# Altium schematic sheet DSM_VB2032-241203_Sch.SchDoc
size A3; SheetNumber: 1; SheetTotal: 1
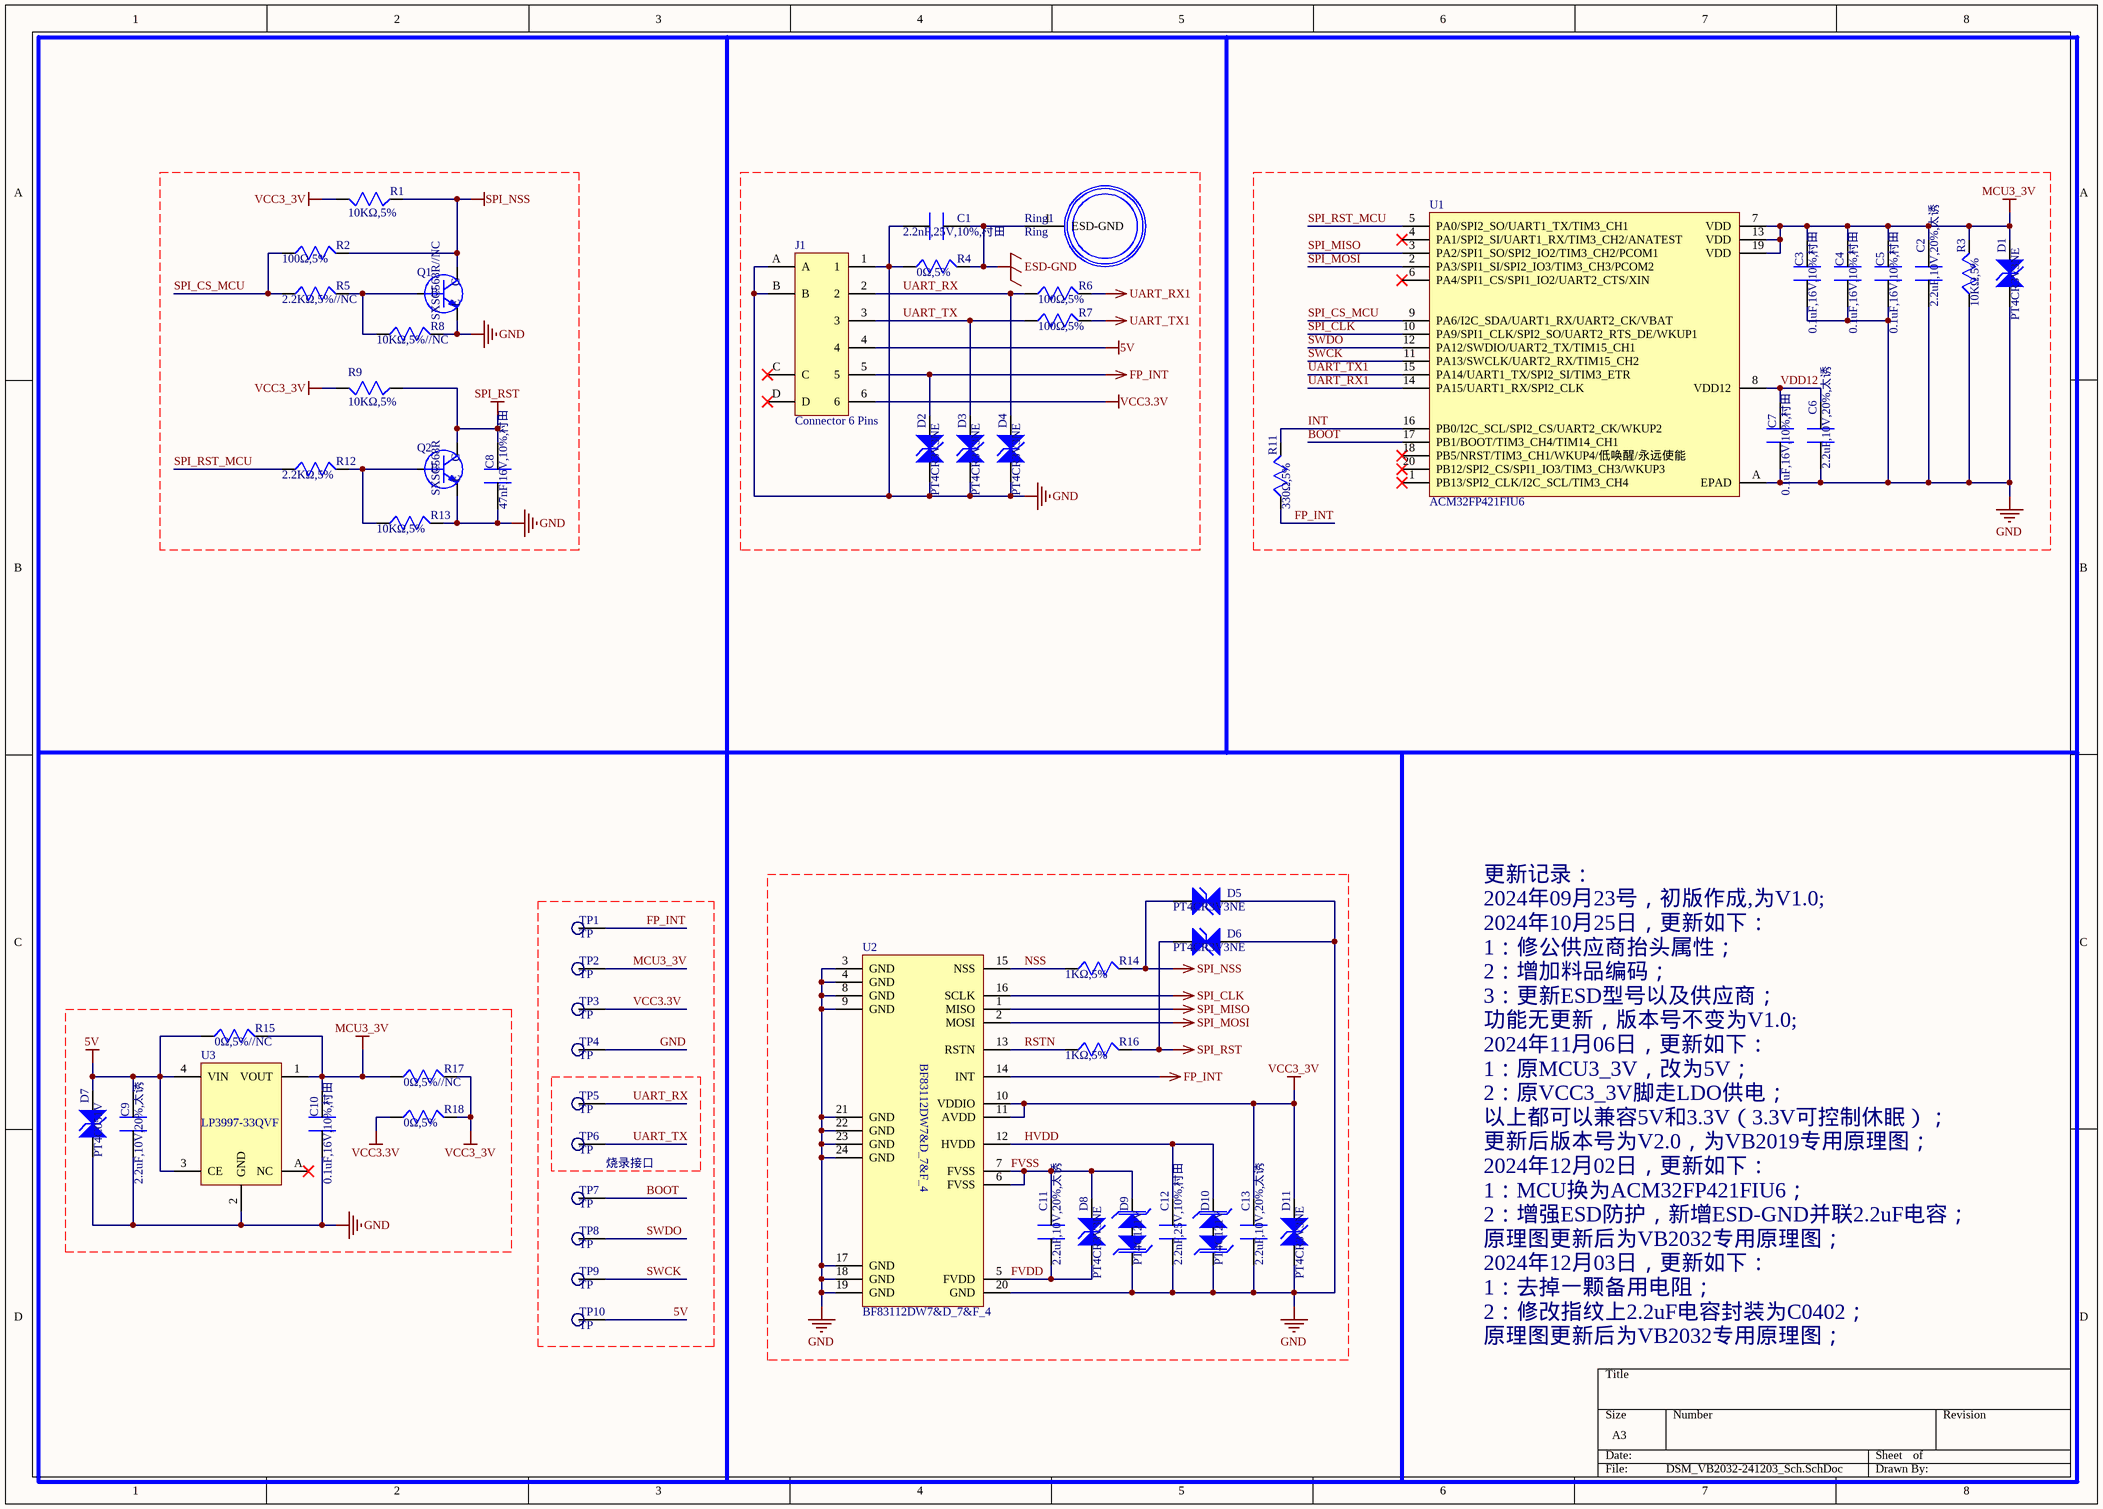
[diagram p0: DSM_VB2032-241203_Sch.SchDoc]

## Parts
C1  2.2nF,25V,10%,村田  [C0201]
C2  2.2uF,10V,20%,太诱  [C0201]
C3  0.1uF,16V,10%,村田  [C0201]
C4  0.1uF,16V,10%,村田  [C0201]
C5  0.1uF,16V,10%,村田  [C0201]
C6  2.2uF,10V,20%,太诱  [C0201]
C7  0.1uF,16V,10%,村田  [C0201]
C8  47nF,16V,10%,村田  [C0201]
C9  2.2uF,10V,20%,太诱  [C0201]
C10  0.1uF,16V,10%,村田  [C0201]
C11  2.2uF,10V,20%,太诱  [CC0402-M]
C12  2.2nF,25V,10%,村田  [C0201]
C13  2.2uF,10V,20%,太诱  [CC0402-M]
D1  PT4CR3V3NE  [SOD-962]
D2  PT4CR3V3NE  [SOD-962]
D3  PT4CR3V3NE  [SOD-962]
D4  PT4CR3V3NE  [SOD-962]
D5  PT4CR3V3NE  [SOD-962]
D6  PT4CR3V3NE  [SOD-962]
D7  PT4C051V  [DFN0603-2L 0.3*0.23 Pitch 0.38]
D8  PT4CR3V3NE  [SOD-962]
D9  PT4C121V  [SOD-962]
D10  PT4C121V  [SOD-962]
D11  PT4CR3V3NE  [SOD-962]
J1  Connector 6 Pins  [A1004LF-06A]
Q1  SXSC568R//NC  [SOT-723]
Q2  SXSC568R  [SOT-723]
R1  10KΩ,5%  [R0201]
R2  100Ω,5%  [R0201]
R3  10KΩ,5%  [R0201]
R4  0Ω,5%  [R0201]
R5  2.2KΩ,5%//NC  [R0201]
R6  100Ω,5%  [R0201]
R7  100Ω,5%  [R0201]
R8  10KΩ,5%//NC  [R0201]
R9  10KΩ,5%  [R0201]
R11  330Ω,5%  [R0201]
R12  2.2KΩ,5%  [R0201]
R13  10KΩ,5%  [R0201]
R14  1KΩ,5%  [R0201]
R15  0Ω,5%//NC  [R0201]
R16  1KΩ,5%  [R0201]
R17  0Ω,5%//NC  [R0201]
R18  0Ω,5%  [R0201]
Ring1  Ring  [Ring]
TP1  TP  [TP（Φ0.5）]
TP2  TP  [TP（Φ0.5）]
TP3  TP  [TP（Φ0.5）]
TP4  TP  [TP（Φ0.5）]
TP5  TP  [TP（Φ0.5）]
TP6  TP  [TP（Φ0.5）]
TP7  TP  [TP（Φ0.5）]
TP8  TP  [TP（Φ0.5）]
TP9  TP  [TP（Φ0.5）]
TP10  TP  [TP（Φ0.5）]
U1  ACM32FP421FIU6  [QFN 20 3*3 Pitch 0.4]
U2  BF83112DW7&D_7&F_4  [BF83112DW7&D_7&F_4]
U3  LP3997-33QVF  [DFN 1*1-4L]

## Nets
5V: C9.2 D7.2 J1.4 R15.1 TP10.1 U3.3(CE) U3.4(VIN)
ESD-GND: C1.1 R4.2 Ring1.1(ESD-GND)
FP_INT: D2.2 J1.5 R11.1 TP1.1 U2.14(INT)
GND: C1.2 C2.1 C3.1 C4.1 C5.1 C6.1 C7.1 C8.1 C9.1 C10.1 C12.1 C13.1 D1.1 D2.1 D3.1 D4.1 D5.1 D6.1 D7.1 D9.2 D10.2 D11.1 J1.1 J1.A J1.B Q1.2(E) Q2.2(E) R3.1 R4.1 R8.2 R13.2 TP4.1 U1.A(EPAD) U2.3(GND) U2.4(GND) U2.8(GND) U2.9(GND) U2.17(GND) U2.18(GND) U2.19(GND) U2.20(GND) U2.21(GND) U2.22(GND) U2.23(GND) U2.24(GND) U3.2(GND)
MCU3_3V: C2.2 C3.2 C4.2 C5.2 C10.2 D1.2 R3.2 R15.2 R17.1 TP2.1 U1.7(VDD) U1.13(VDD) U1.19(VDD) U3.1(VOUT)
SPI_CLK: U1.10(PA9/SPI1_CLK/SPI2_SO/UART2_RTS_DE/WKUP1) U2.16(SCLK)
SPI_MISO: U1.3(PA2/SPI1_SO/SPI2_IO2/TIM3_CH2/PCOM1) U2.1(MISO)
SPI_MOSI: U1.2(PA3/SPI1_SI/SPI2_IO3/TIM3_CH3/PCOM2) U2.2(MOSI)
SPI_NSS: D5.2 Q1.3(C) R1.1 R2.2 R14.2
SPI_RST: C8.2 D6.2 Q2.3(C) R9.1 R16.2
UART_RX1: R6.2 U1.14(PA15/UART1_RX/SPI2_CLK)
UART_TX1: R7.2 U1.15(PA14/UART1_TX/SPI2_SI/TIM3_ETR)
VCC3.3V: J1.6 R18.1 TP3.1
VCC3_3V: C13.2 D11.2 R1.2 R9.2 R17.2 R18.2 U2.10(VDDIO) U2.11(AVDD)
BOOT: TP7.1 U1.17(PB1/BOOT/TIM3_CH4/TIM14_CH1)
FVDD: C11.1 D8.1 U2.5(FVDD)
FVSS: C11.2 D8.2 D9.1 U2.6(FVSS) U2.7(FVSS)
HVDD: C12.2 D10.1 U2.12(HVDD)
INT: R11.2 U1.16(PB0/I2C_SCL/SPI2_CS/UART2_CK/WKUP2)
NSS: R14.1 U2.15(NSS)
RSTN: R16.1 U2.13(RSTN)
SPI_CS_MCU: R2.1 R5.1 U1.9(PA6/I2C_SDA/UART1_RX/UART2_CK/VBAT)
SPI_RST_MCU: R12.1 U1.5(PA0/SPI2_SO/UART1_TX/TIM3_CH1)
SWCK: TP9.1 U1.11(PA13/SWCLK/UART2_RX/TIM15_CH2)
SWDO: TP8.1 U1.12(PA12/SWDIO/UART2_TX/TIM15_CH1)
UART_RX: D4.2 J1.2 R6.1 TP5.1
UART_TX: D3.2 J1.3 R7.1 TP6.1
VDD12: C6.2 C7.2 U1.8(VDD12)
NetQ1_1: Q1.1(B) R5.2 R8.1
NetQ2_1: Q2.1(B) R12.2 R13.1

Not connected (* = marked no-connect by the designer): J1 C* D*; U1 1(PB13/SPI2_CLK/I2C_SCL/TIM3_CH4)* 4(PA1/SPI2_SI/UART1_RX/TIM3_CH2/ANATEST)* 6(PA4/SPI1_CS/SPI1_IO2/UART2_CTS/XIN)* 18(PB5/NRST/TIM3_CH1/WKUP4/低唤醒/永远使能)* 20(PB12/SPI2_CS/SPI1_IO3/TIM3_CH3/WKUP3)*; U3 A(NC)*

## Notes on the sheet
- 烧录接口
- 更新记录：
  2024年09月23号，初版作成,为V1.0;
  2024年10月25日，更新如下：
  1：修公供应商抬头属性；
  2：增加料品编码；
  3：更新ESD型号以及供应商；
  功能无更新，版本号不变为V1.0;
  2024年11月06日，更新如下：
  1：原MCU3_3V，改为5V；
  2：原VCC3_3V脚走LDO供电；
  以上都可以兼容5V和3.3V（3.3V可控制休眠）；
  更新后版本号为V2.0，为VB2019专用原理图；
  2024年12月02日，更新如下：
  1：MCU换为ACM32FP421FIU6；
  2：增强ESD防护，新增ESD-GND并联2.2uF电容；
  原理图更新后为VB2032专用原理图；
  2024年12月03日，更新如下：
  1：去掉一颗备用电阻；
  2：修改指纹上2.2uF电容封装为C0402；
  原理图更新后为VB2032专用原理图；

## Library data of the parts
C1 C12 = Cap: 贴片电容; Material code: 3040100000019; supplier: 深圳市扬盛达科技有限公司
C2 C6 C9 C11 C13 = Cap: 贴片电容; Material code: 3040000000063; supplier: 深圳市扬盛达科技有限公司
C3-C5 C7 C10 = Cap: 贴片电容; Material code: 3040100000012; supplier: 深圳市扬盛达科技有限公司
C8 = Cap: 贴片电容; Material code: 3040100000024; supplier: 深圳市扬盛达科技有限公司
D1-D6 D8 D11 = ESD: 双向静电二极管; Material code: 3160100000178; supplier: 深圳市玛珂斯科技有限公司
D7 = ESD: 双向静电二极管; Material code: 3160100000174; supplier: 深圳市玛珂斯科技有限公司
D9 D10 = TVS: 双向瞬态抑制二极管; Material code: 3160100000173; supplier: 深圳市玛珂斯科技有限公司
J1 = Connector 6 Pins: 连接器; supplier: 深圳市富美康电子有限公司; Material code: *
Q1 Q2 = NPN BCE: NPN型三极管; Material code: 3160100000013; supplier: 深圳市扬盛达科技有限公司
R1 R3 R8 R9 R13 = RES: 贴片电阻; Material code: 3050000000004; supplier: 深圳市扬盛达科技有限公司
R2 R6 R7 = RES: 贴片电阻; Material code: 3050000000018; supplier: 深圳市扬盛达科技有限公司
R4 R15 R17 R18 = RES: 贴片电阻; Material code: 3050000000061; supplier: 深圳市扬盛达科技有限公司
R5 R12 = RES: 贴片电阻; Material code: 3050000000006; supplier: 深圳市扬盛达科技有限公司
R11 = RES: 贴片电阻; Material code: 3050000000007; supplier: 深圳市扬盛达科技有限公司
R14 R16 = RES: 贴片电阻; Material code: 3050000000003; supplier: 深圳市扬盛达科技有限公司
Ring1 = Ring: 金属环; supplier: 深圳市添营精密科技有限公司&东莞市飞佳五金有限公司&东莞市盟展五金科技有限公司; Material code: *
TP1-TP10 = TP: 非正常物料无需采购; Material code: 无; supplier: 非正常物料线路板厂会做好的
U1 = ACM32FP421: 微控制单元; Material code: 3350000000037; supplier: 上海航芯电子科技股份有限公司
U2 = BF83112DW7&D_7&F_4: 电容按压式指纹识别芯片; supplier: 深圳贝特莱电子科技股份有限公司; Material code: *
U3 = LDO 4 Pins: 线性稳压器; supplier: 深圳市思派德科技有限公司; Material code: *